# EAGLE design ExtenderCoco (EAGLE 7.7.0)
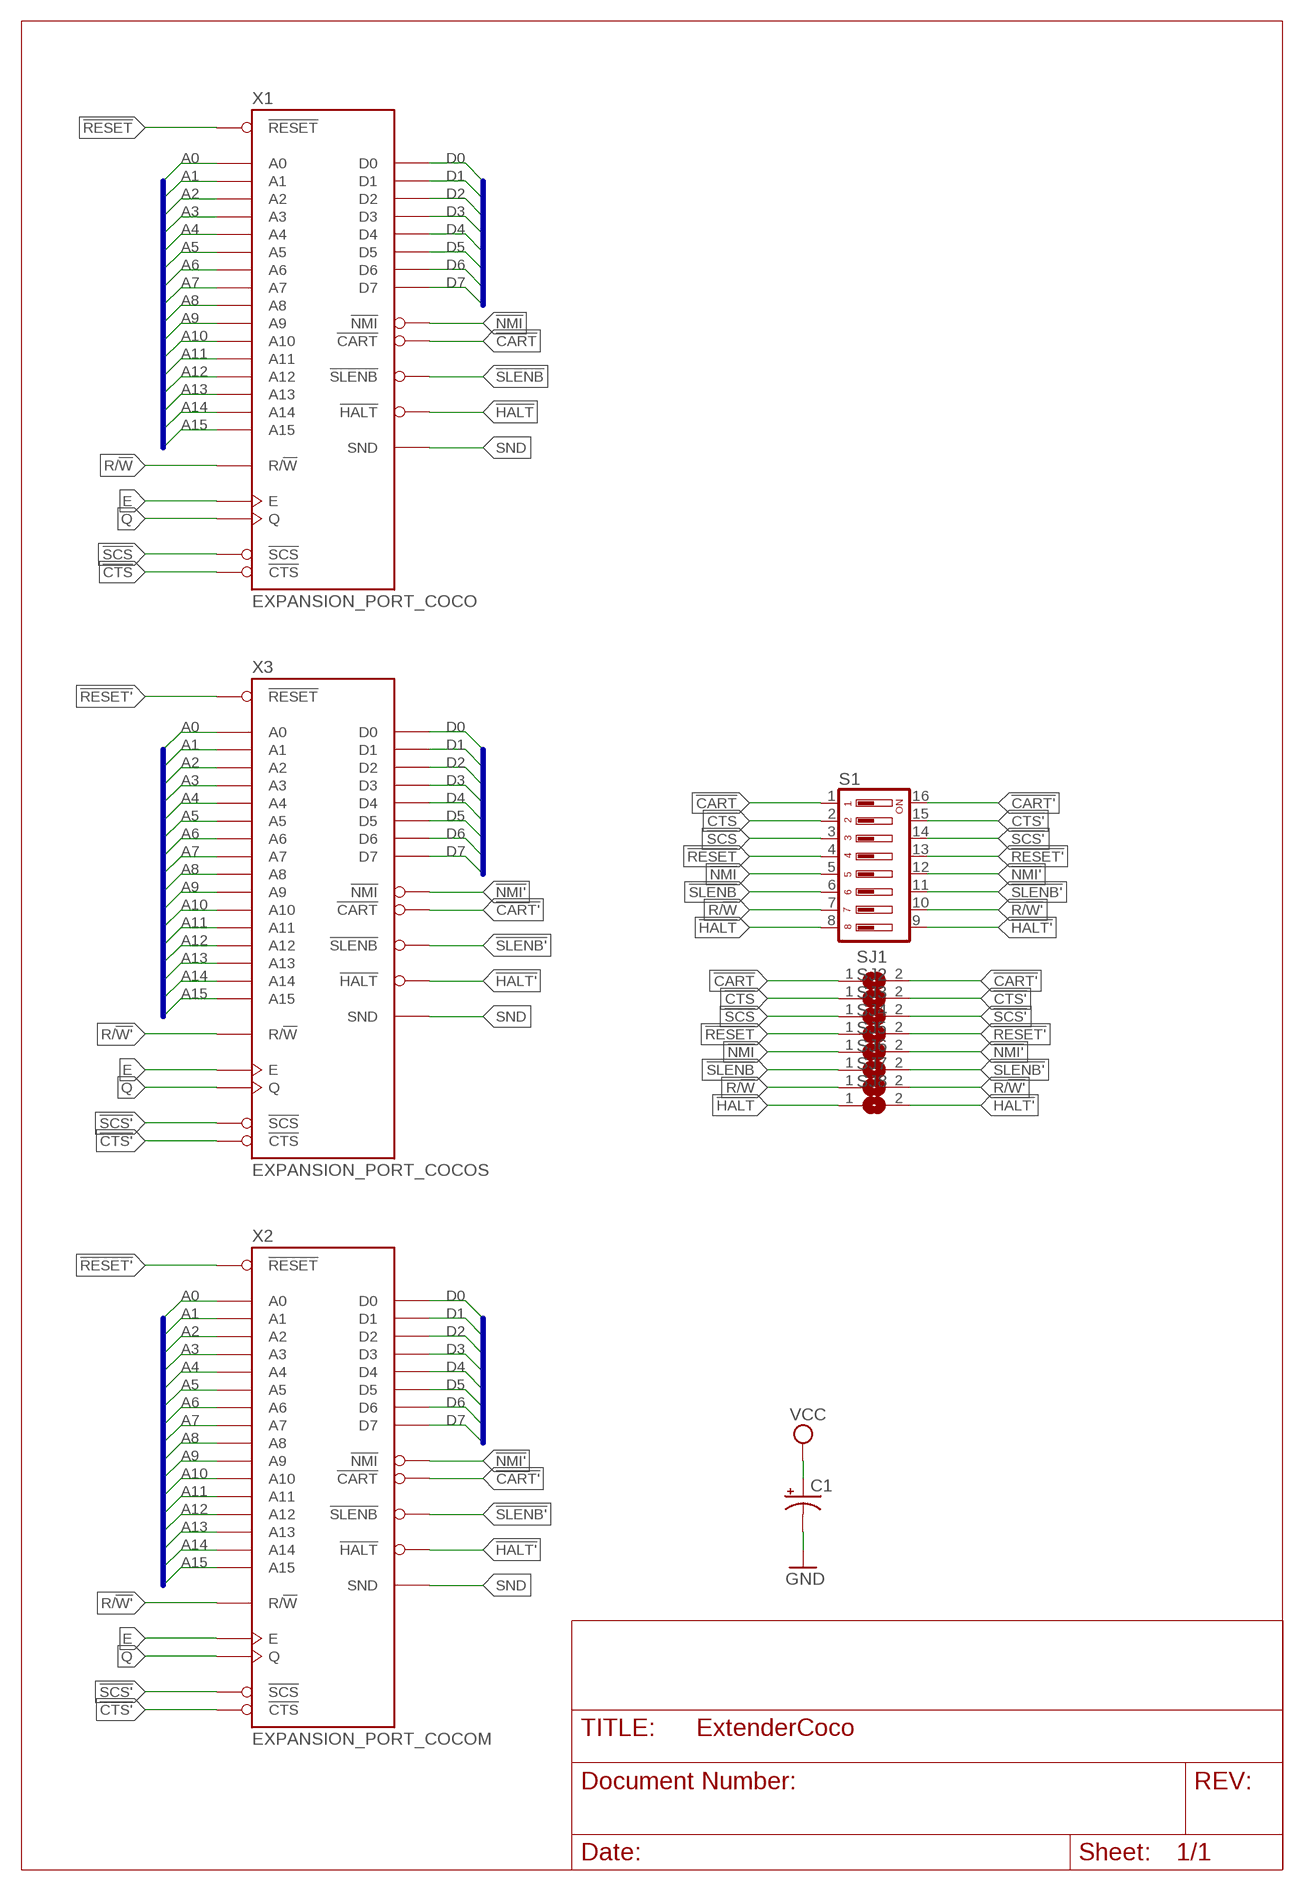
[diagram p0: schematic, sheet 1]

## Parts
C1  CPOL-USE2-5  [E2-5]
S1  DP08  [DP-08]
SJ1  SJ  [SJ]
SJ2  SJ  [SJ]
SJ3  SJ  [SJ]
SJ4  SJ  [SJ]
SJ5  SJ  [SJ]
SJ6  SJ  [SJ]
SJ7  SJ  [SJ]
SJ8  SJ  [SJ]
X1  EXPANSION_PORT_COCO  [MA20-2]
X2  EXPANSION_PORT_COCOM  [FE20-2]
X3  EXPANSION_PORT_COCOS  [MA20-2_SHORT]

## Nets
!CART: S1.1 SJ1.1 X1.8(!CART)
!CART': S1.16 SJ1.2 X2.8(!CART) X3.8(!CART)
!CTS: S1.2 SJ2.1 X1.32(!CTS)
!CTS': S1.15 SJ2.2 X2.32(!CTS) X3.32(!CTS)
!HALT: S1.8 SJ8.1 X1.3(!HALT)
!HALT': S1.9 SJ8.2 X2.3(!HALT) X3.3(!HALT)
!NMI: S1.5 SJ5.1 X1.4(!NMI)
!NMI': S1.12 SJ5.2 X2.4(!NMI) X3.4(!NMI)
!RESET: S1.4 SJ4.1 X1.5(!RESET)
!RESET': S1.13 SJ4.2 X2.5(!RESET) X3.5(!RESET)
!SCS: S1.3 SJ3.1 X1.36(!SCS)
!SCS': S1.14 SJ3.2 X2.36(!SCS) X3.36(!SCS)
!SLENB: S1.6 SJ6.1 X1.40(!SLENB)
!SLENB': S1.11 SJ6.2 X2.40(!SLENB) X3.40(!SLENB)
A0: X1.19(A0) X2.19(A0) X3.19(A0)
A1: X1.20(A1) X2.20(A1) X3.20(A1)
A2: X1.21(A2) X2.21(A2) X3.21(A2)
A3: X1.22(A3) X2.22(A3) X3.22(A3)
A4: X1.23(A4) X2.23(A4) X3.23(A4)
A5: X1.24(A5) X2.24(A5) X3.24(A5)
A6: X1.25(A6) X2.25(A6) X3.25(A6)
A7: X1.26(A7) X2.26(A7) X3.26(A7)
A8: X1.27(A8) X2.27(A8) X3.27(A8)
A9: X1.28(A9) X2.28(A9) X3.28(A9)
A10: X1.29(A10) X2.29(A10) X3.29(A10)
A11: X1.30(A11) X2.30(A11) X3.30(A11)
A12: X1.31(A12) X2.31(A12) X3.31(A12)
A13: X1.37(A13) X2.37(A13) X3.37(A13)
A14: X1.38(A14) X2.38(A14) X3.38(A14)
A15: X1.39(A15) X2.39(A15) X3.39(A15)
D0: X1.10(D0) X2.10(D0) X3.10(D0)
D1: X1.11(D1) X2.11(D1) X3.11(D1)
D2: X1.12(D2) X2.12(D2) X3.12(D2)
D3: X1.13(D3) X2.13(D3) X3.13(D3)
D4: X1.14(D4) X2.14(D4) X3.14(D4)
D5: X1.15(D5) X2.15(D5) X3.15(D5)
D6: X1.16(D6) X2.16(D6) X3.16(D6)
D7: X1.17(D7) X2.17(D7) X3.17(D7)
E: X1.6(E) X2.6(E) X3.6(E)
GND: C1.-
Q: X1.7(Q) X2.7(Q) X3.7(Q)
R/!W: S1.7 SJ7.1 X1.18(R/!W)
R/!W': S1.10 SJ7.2 X2.18(R/!W) X3.18(R/!W)
SND: X1.35(SND) X2.35(SND) X3.35(SND)
VCC: C1.+

## Buses
A[0..15]
D[0..7]

## Power pins joined to a net without a drawn wire
+12V: X1.2(+12V) X2.2(+12V) X3.2(+12V)
-12V: X1.1(-12V) X2.1(-12V) X3.1(-12V)
GND: X1.33(GND) X1.34(GND) X2.33(GND) X2.34(GND) X3.33(GND) X3.34(GND)
VCC: X1.9(VCC) X2.9(VCC) X3.9(VCC)

## Library data of the parts
C1 = rcl:CPOL-US: POLARIZED CAPACITOR, American symbol
S1 = switch-dil:DP08: DIL/CODE SWITCH; MPN: DP08; OC_FARNELL: 9471626; OC_NEWARK: 73J0035
SJ1-SJ8 = jumper:SJ: SMD solder JUMPER
X1-X3 = coco:EXPANSION_PORT_COCO

## Board
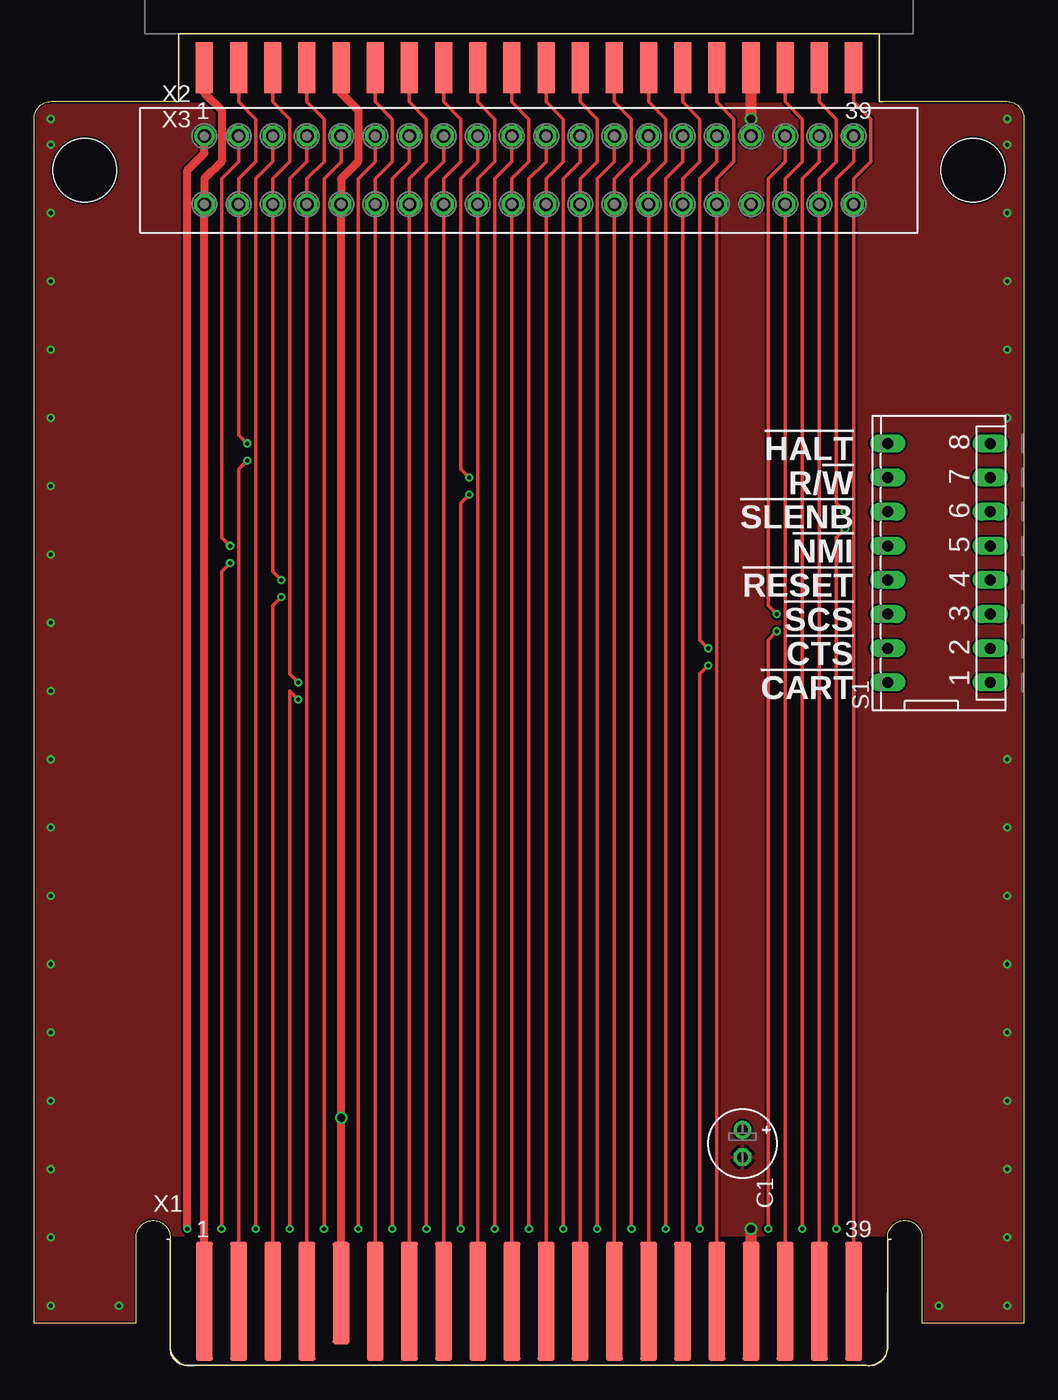
[diagram p1: board, top side]
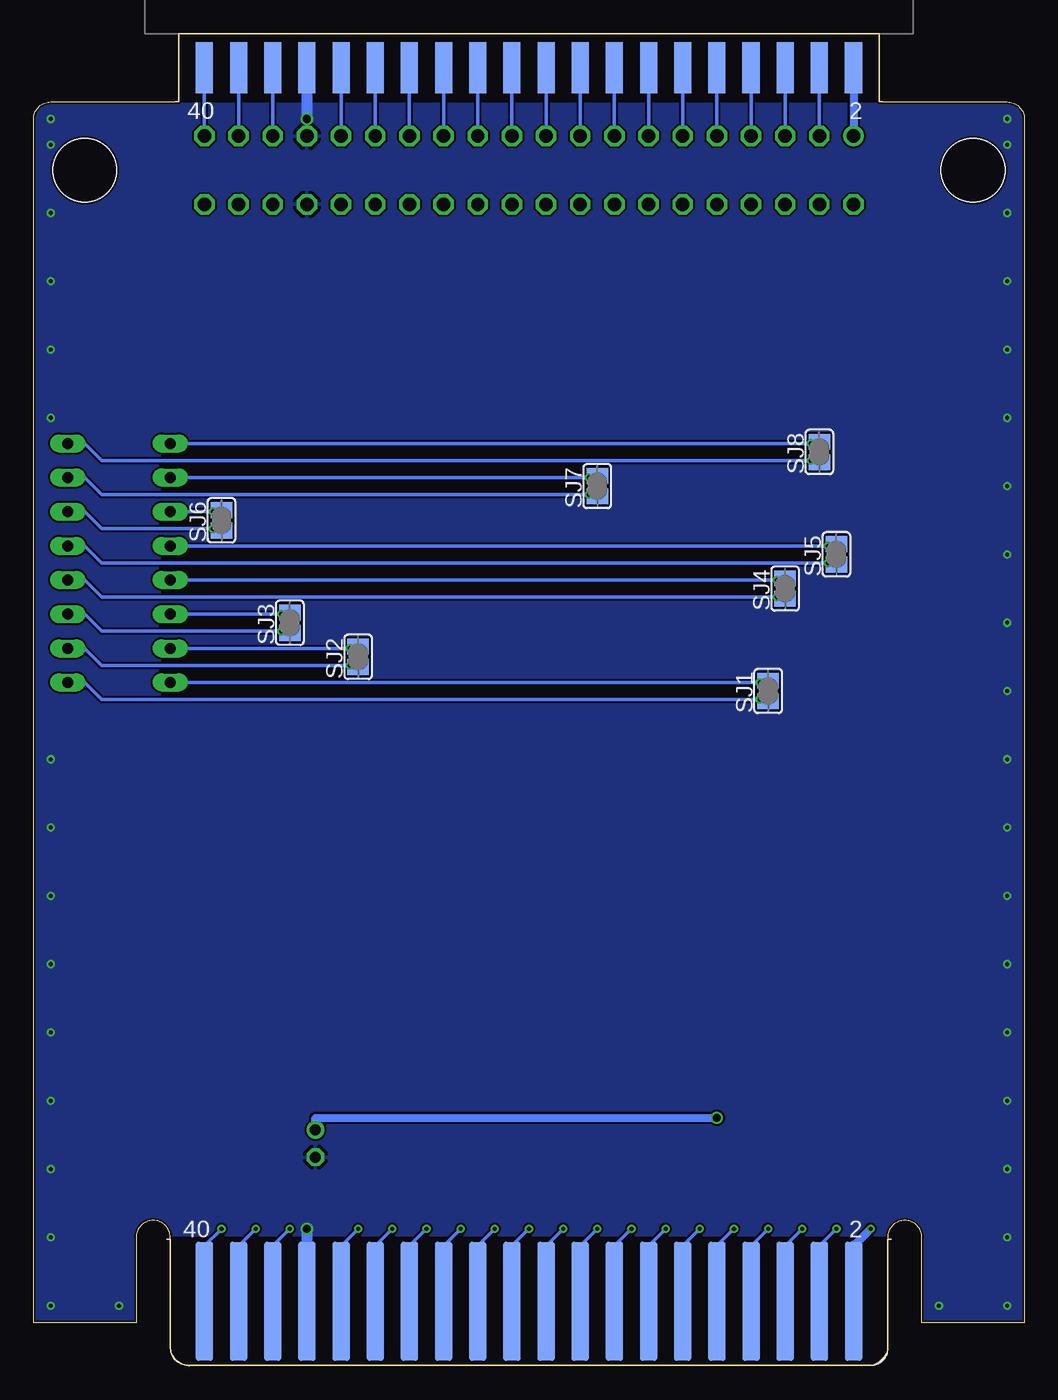
[diagram p2: board, bottom side, seen from below]

Size 73.66 x 99.09 mm. Coordinates in mm from the lower left corner, seen from the top.
Outline: 10.79,99.09 10.79,94.01 1.27,94.01 arc90 0,92.74 0,3.21 7.62,3.21 7.62,9.56 arc-90 8.89,10.83 arc-90 10.16,9.56 10.16,1.3 arc90 12.06,0.03 62.21,0.03 arc90 63.48,1.3 63.5,9.56 arc-90 64.77,10.83 64.77,10.83 arc-90 66.04,9.56 66.04,3.21 73.66,3.21 73.66,92.74 arc90 72.39,94.01 62.86,94.01 62.86,99.09 10.79,99.09
Copper layers (1*16): Top 0.035mm / dielectric 1.5mm / Bottom 0.035mm
Design rules "hackvana": minimum track width 6mil, minimum drill 0.3mm, track to track 6mil, track to pad 6mil, pad to pad 6mil, via to via 6mil, smd to smd 0mil, copper to edge 6mil, drill to drill 6mil, minimum pad ring 10mil, minimum via ring 6mil, stop-mask expansion 2mil, vias tented up to drill 100mil, thermal gap 10mil
Holes 4.75 mm at 3.81,88.93 69.85,88.93

### Footprints (pad centres in the part's own frame; a part is rotated, then mirrored left to right if it is on the bottom)
E2-5 = drill 0.813 pad 1.27: + -1.016,0 | drill 0.813 pad 1.27 octagon: - 1.016,0
DP-08 = drill 0.813 long: 1 -8.89,-3.81; 2 -6.35,-3.81; 3 -3.81,-3.81; 4 -1.27,-3.81; 5 1.27,-3.81; 6 3.81,-3.81; 7 6.35,-3.81; 8 8.89,-3.81; 9 8.89,3.81; 10 6.35,3.81; 11 3.81,3.81; 12 1.27,3.81; 13 -1.27,3.81; 14 -3.81,3.81; 15 -6.35,3.81; 16 -8.89,3.81
SJ = smd 1.168 x 1.6: 1 -0.762,0; 2 0.762,0
MA20-2 = smd 1.27 x 8.89: 1 -24.13,-0.305; 3 -21.59,-0.305; 5 -19.05,-0.305; 7 -16.51,-0.305; 11 -11.43,-0.305; 13 -8.89,-0.305; 15 -6.35,-0.305; 17 -3.81,-0.305; 19 -1.27,-0.305; 21 1.27,-0.305; 23 3.81,-0.305; 25 6.35,-0.305; 27 8.89,-0.305; 29 11.43,-0.305; 31 13.97,-0.305; 33 16.51,-0.305; 35 19.05,-0.305; 37 21.59,-0.305; 39 24.13,-0.305 | smd 1.27 x 8.89 bottom: 2 -24.13,-0.305; 4 -21.59,-0.305; 6 -19.05,-0.305; 8 -16.51,-0.305; 10 -13.97,-0.305; 12 -11.43,-0.305; 14 -8.89,-0.305; 16 -6.35,-0.305; 18 -3.81,-0.305; 20 -1.27,-0.305; 22 1.27,-0.305; 24 3.81,-0.305; 26 6.35,-0.305; 28 8.89,-0.305; 30 11.43,-0.305; 32 13.97,-0.305; 34 16.51,-0.305; 36 19.05,-0.305; 38 21.59,-0.305; 40 24.13,-0.305 | smd 1.27 x 7.62: 9 -13.97,0.305
FE20-2 = drill 1 octagon: 1 -24.13,-2.54; 3 -21.59,-2.54; 4 -21.59,2.54; 5 -19.05,-2.54; 6 -19.05,2.54; 7 -16.51,-2.54; 8 -16.51,2.54; 9 -13.97,-2.54; 10 -13.97,2.54; 11 -11.43,-2.54; 12 -11.43,2.54; 13 -8.89,-2.54; 14 -8.89,2.54; 15 -6.35,-2.54; 16 -6.35,2.54; 17 -3.81,-2.54; 18 -3.81,2.54; 19 -1.27,-2.54; 20 -1.27,2.54; 21 1.27,-2.54; 22 1.27,2.54; 23 3.81,-2.54; 24 3.81,2.54; 25 6.35,-2.54; 26 6.35,2.54; 27 8.89,-2.54; 28 8.89,2.54; 29 11.43,-2.54; 30 11.43,2.54; 31 13.97,-2.54; 32 13.97,2.54; 33 16.51,-2.54; 34 16.51,2.54; 35 19.05,-2.54; 36 19.05,2.54; 37 21.59,-2.54; 38 21.59,2.54; 39 24.13,-2.54; 40 24.13,2.54 | drill 1: 2 -24.13,2.54
MA20-2_SHORT = smd 1.27 x 3.81: 1 -24.13,0; 3 -21.59,0; 5 -19.05,0; 7 -16.51,0; 9 -13.97,0; 11 -11.43,0; 13 -8.89,0; 15 -6.35,0; 17 -3.81,0; 19 -1.27,0; 21 1.27,0; 23 3.81,0; 25 6.35,0; 27 8.89,0; 29 11.43,0; 31 13.97,0; 33 16.51,0; 35 19.05,0; 37 21.59,0; 39 24.13,0 | smd 1.27 x 3.81 bottom: 2 -24.13,0; 4 -21.59,0; 6 -19.05,0; 8 -16.51,0; 10 -13.97,0; 12 -11.43,0; 14 -8.89,0; 16 -6.35,0; 18 -3.81,0; 20 -1.27,0; 22 1.27,0; 24 3.81,0; 26 6.35,0; 28 8.89,0; 30 11.43,0; 32 13.97,0; 34 16.51,0; 36 19.05,0; 38 21.59,0; 40 24.13,0

### Placement (x,y rotation side)
C1  52.7,16.54 270 top
S1  67.31,59.72 90 top
SJ1  19.05,50.2 90 bottom
SJ2  49.53,52.74 90 bottom
SJ3  54.61,55.28 90 bottom
SJ4  17.78,57.82 90 bottom
SJ5  13.97,60.36 90 bottom
SJ6  59.69,62.9 90 bottom
SJ7  31.75,65.44 90 bottom
SJ8  15.24,67.98 90 bottom
X1  36.83,5.11 0 top
X2  36.83,88.93 0 top
X3  36.83,96.55 0 top

### Tracks (layer width: path | path; a pad name or v marks a point on that pad's centre or on a via)
!CART  (via drill 0.3)
  Top 0.254: v19.68,49.56 19.05,50.2 v19.05,10.19
  Bottom 0.254: X1.8 20.32,8.92 v19.05,10.19 | S1.1 69.85,50.83 68.58,49.56 v19.68,49.56 19.56,49.43 SJ1.1
!CART'  (via drill 0.3)
  Top 0.254: v19.68,50.83 19.05,51.47 19.05,88.3 20.32,89.57 X2.8
  Bottom 0.254: S1.16 v19.68,50.83 19.56,50.96 SJ1.2 | X3.8 X2.8
!CTS  (via drill 0.3)
  Top 0.254: v50.16,52.1 49.53,51.47 v49.53,10.19
  Bottom 0.254: X1.32 50.8,8.92 v49.53,10.19 | S1.2 69.85,53.37 68.58,52.1 v50.16,52.1 50.04,51.97 SJ2.1
!CTS'  (via drill 0.3)
  Top 0.254: v50.16,53.37 49.53,54.01 49.53,88.3 50.8,89.57 X2.32
  Bottom 0.254: S1.15 v50.16,53.37 50.04,53.5 SJ2.2 | X3.32 X2.32
!HALT  (via drill 0.3)
  Top 0.254: X1.3 15.24,66.71 v15.88,67.34
  Bottom 0.254: S1.8 69.85,68.61 68.58,67.34 v15.88,67.34 15.75,67.21 SJ8.1
!HALT'  (via drill 0.3)
  Top 0.254: v15.88,68.61 15.24,69.25 X2.3 15.24,88.3 16.51,89.57 16.51,92.74 15.24,94.01 X3.3
  Bottom 0.254: S1.9 v15.88,68.61 15.75,68.74 SJ8.2
!NMI  (via drill 0.3)
  Top 0.254: v14.6,59.72 13.97,59.09 v13.97,10.19
  Bottom 0.254: X1.4 15.24,8.92 v13.97,10.19 | S1.5 69.85,60.99 68.58,59.72 v14.6,59.72 14.48,59.59 SJ5.1
!NMI'  (via drill 0.3)
  Top 0.254: v14.6,60.99 13.97,61.63 13.97,88.3 15.24,89.57 X2.4
  Bottom 0.254: S1.12 v14.6,60.99 14.48,61.12 SJ5.2 | X3.4 X2.4
!RESET  (via drill 0.3)
  Top 0.254: v18.41,57.18 17.78,56.55 X1.5
  Bottom 0.254: S1.4 69.85,58.45 68.58,57.18 v18.41,57.18 18.29,57.05 SJ4.1
!RESET'  (via drill 0.3)
  Top 0.254: v18.41,58.45 17.78,59.09 X2.5 17.78,88.3 19.05,89.57 19.05,92.74 17.78,94.01 X3.5
  Bottom 0.254: S1.13 v18.41,58.45 18.29,58.58 SJ4.2
!SCS  (via drill 0.3)
  Top 0.254: v55.24,54.64 54.61,54.01 v54.61,10.19
  Bottom 0.254: X1.36 55.88,8.92 v54.61,10.19 | S1.3 69.85,55.91 68.58,54.64 v55.24,54.64 55.12,54.51 SJ3.1
!SCS'  (via drill 0.3)
  Top 0.254: v55.24,55.91 54.61,56.55 54.61,88.3 55.88,89.57 X2.36
  Bottom 0.254: S1.14 v55.24,55.91 55.12,56.04 SJ3.2 | X3.36 X2.36
!SLENB  (via drill 0.3)
  Top 0.254: v60.33,62.26 59.69,61.63 v59.69,10.19
  Bottom 0.254: X1.40 60.96,8.92 v59.69,10.19 | S1.6 69.85,63.53 68.58,62.26 v60.33,62.26 60.2,62.13 SJ6.1
!SLENB'  (via drill 0.3)
  Top 0.254: v60.33,63.53 59.69,64.17 59.69,88.3 60.96,89.57 X2.40
  Bottom 0.254: S1.11 v60.33,63.53 60.2,63.66 SJ6.2 | X3.40 X2.40
+12V  (via drill 0.3)
  Top 0.61: v11.43,10.19 11.43,88.93 12.7,90.2 X2.2
  Bottom 0.61: 12.7,8.92 v11.43,10.19 | X3.2 X2.2
  Bottom 0.813: X1.2 12.7,8.92
-12V
  Top 0.61: X1.1 X2.1 12.7,88.3 13.97,89.57 13.97,93.38 12.7,94.65 X3.1
A0
  Top 0.254: X1.19 X2.19 35.56,88.3 36.83,89.57 36.83,92.74 35.56,94.01 X3.19
A1  (via drill 0.3)
  Top 0.254: X2.20 35.56,89.57 34.29,88.3 v34.29,10.19
  Bottom 0.254: X1.20 35.56,8.92 v34.29,10.19 | X3.20 X2.20
A2
  Top 0.254: X1.21 X2.21 38.1,88.3 39.37,89.57 39.37,92.74 38.1,94.01 X3.21
A3  (via drill 0.3)
  Top 0.254: X2.22 38.1,89.57 36.83,88.3 v36.83,10.19
  Bottom 0.254: X1.22 38.1,8.92 v36.83,10.19 | X3.22 X2.22
A4
  Top 0.254: X1.23 X2.23 40.64,88.3 41.91,89.57 41.91,92.74 40.64,94.01 X3.23
A5  (via drill 0.3)
  Top 0.254: X2.24 40.64,89.57 39.37,88.3 v39.37,10.19
  Bottom 0.254: X1.24 40.64,8.92 v39.37,10.19 | X3.24 X2.24
A6
  Top 0.254: X1.25 X2.25 43.18,88.3 44.45,89.57 44.45,92.74 43.18,94.01 X3.25
A7  (via drill 0.3)
  Top 0.254: X2.26 43.18,89.57 41.91,88.3 v41.91,10.19
  Bottom 0.254: X1.26 43.18,8.92 v41.91,10.19 | X3.26 X2.26
A8
  Top 0.254: X1.27 X2.27 45.72,88.3 46.99,89.57 46.99,92.74 45.72,94.01 X3.27
A9  (via drill 0.3)
  Top 0.254: X2.28 45.72,89.57 44.45,88.3 v44.45,10.19
  Bottom 0.254: X1.28 45.72,8.92 v44.45,10.19 | X3.28 X2.28
A10
  Top 0.254: X1.29 X2.29 48.26,88.3 49.53,89.57 49.53,92.74 48.26,94.01 X3.29
A11  (via drill 0.3)
  Top 0.254: X2.30 48.26,89.57 46.99,88.3 v46.99,10.19
  Bottom 0.254: X1.30 48.26,8.92 v46.99,10.19 | X3.30 X2.30
A12
  Top 0.254: X1.31 X2.31 50.8,88.3 52.07,89.57 52.07,92.74 50.8,94.01 X3.31
A13
  Top 0.254: X1.37 X2.37 58.42,88.3 59.69,89.57 59.69,92.74 58.42,94.01 X3.37
A14  (via drill 0.3)
  Top 0.254: X2.38 58.42,89.57 57.15,88.3 v57.15,10.19
  Bottom 0.254: X1.38 58.42,8.92 v57.15,10.19 | X3.38 X2.38
A15
  Top 0.254: X1.39 X2.39 60.96,88.3 62.23,89.57 62.23,92.74 60.96,94.01 X3.39
D0  (via drill 0.3)
  Top 0.254: X2.10 22.86,89.57 21.59,88.3 v21.59,10.19
  Bottom 0.254: X1.10 22.86,8.92 v21.59,10.19 | X3.10 X2.10
D1
  Top 0.254: X1.11 X2.11 25.4,88.3 26.67,89.57 26.67,92.74 25.4,94.01 X3.11
D2  (via drill 0.3)
  Top 0.254: X2.12 25.4,89.57 24.13,88.3 v24.13,10.19
  Bottom 0.254: X1.12 25.4,8.92 v24.13,10.19 | X3.12 X2.12
D3
  Top 0.254: X1.13 X2.13 27.94,88.3 29.21,89.57 29.21,92.74 27.94,94.01 X3.13
D4  (via drill 0.3)
  Top 0.254: X2.14 27.94,89.57 26.67,88.3 v26.67,10.19
  Bottom 0.254: X1.14 27.94,8.92 v26.67,10.19 | X3.14 X2.14
D5
  Top 0.254: X1.15 X2.15 30.48,88.3 31.75,89.57 31.75,92.74 30.48,94.01 X3.15
D6  (via drill 0.3)
  Top 0.254: X2.16 30.48,89.57 29.21,88.3 v29.21,10.19
  Bottom 0.254: X1.16 30.48,8.92 v29.21,10.19 | X3.16 X2.16
D7
  Top 0.254: X1.17 X2.17 33.02,88.3 34.29,89.57 34.29,92.74 33.02,94.01 X3.17
E  (via drill 0.3)
  Top 0.254: X2.6 17.78,89.57 16.51,88.3 v16.51,10.19
  Bottom 0.254: X1.6 17.78,8.92 v16.51,10.19 | X3.6 X2.6
GND  (via drill 0.3, 0.6)
  Top 0.813: v53.34,92.74 X3.34 | X1.34 v53.34,10.19
  Bottom 0.813: X3.34 v53.34,92.74 | v53.34,10.19 X1.34
  other vias: 1.27,4.48 6.35,4.48 72.39,92.74 1.27,92.74 1.27,9.56 1.27,14.64 1.27,19.72 1.27,24.8 1.27,29.88 1.27,34.96 1.27,50.2 1.27,55.28 1.27,70.52 1.27,65.44 1.27,60.36 1.27,85.76 1.27,80.68 1.27,90.84 72.39,90.84 72.39,85.76 72.39,80.68 72.39,9.56 72.39,14.64 72.39,19.72 72.39,24.8 72.39,29.88 72.39,34.96 72.39,70.52 1.27,40.04 72.39,40.04 1.27,75.6 72.39,75.6 67.31,4.48 72.39,4.48 1.27,45.12 72.39,45.12
  pour Bottom: 10.16,9.56 arc90 8.89,10.83 arc90 7.62,9.56 7.62,3.21 0,3.21 0,92.74 arc-90 1.27,94.01 72.39,94.01 arc-90 73.66,92.74 73.66,3.21 66.04,3.21 66.04,9.56 arc90 64.77,10.83 arc90 63.5,9.56
  pour Top: 10.16,9.56 arc90 8.89,10.83 arc90 7.62,9.56 7.62,3.21 0,3.21 0,92.74 arc-90 1.27,94.01 72.39,94.01 arc-90 73.66,92.74 73.66,3.21 66.04,3.21 66.04,9.56 arc90 64.77,10.83 arc90 63.5,9.56
Q
  Top 0.254: X1.7 X2.7 20.32,88.3 21.59,89.57 21.59,92.74 20.32,94.01 X3.7
R/!W  (via drill 0.3)
  Top 0.254: v32.38,64.8 31.75,64.17 v31.75,10.19
  Bottom 0.254: X1.18 33.02,8.92 v31.75,10.19 | S1.7 69.85,66.07 68.58,64.8 v32.38,64.8 32.26,64.67 SJ7.1
R/!W'  (via drill 0.3)
  Top 0.254: v32.38,66.07 31.75,66.71 31.75,88.3 33.02,89.57 X2.18
  Bottom 0.254: S1.10 v32.38,66.07 32.26,66.2 SJ7.2 | X3.18 X2.18
SND
  Top 0.254: X1.35 X2.35 55.88,88.3 57.15,89.57 57.15,92.74 55.88,94.01 X3.35
VCC  (via drill 0.6)
  Top 0.61: X1.9 v22.86,18.45 X2.9 22.86,88.3 24.13,89.57 24.13,93.38 22.86,94.65 X3.9
  Bottom 0.61: C1.+ 52.7,18.45 v22.86,18.45

### Text on the board
tNames: !HALT | R/!W | !SLENB | !NMI | !RESET | !SCS | !CTS | !CART